# EAGLE design IOIO Pump (EAGLE 6.3)
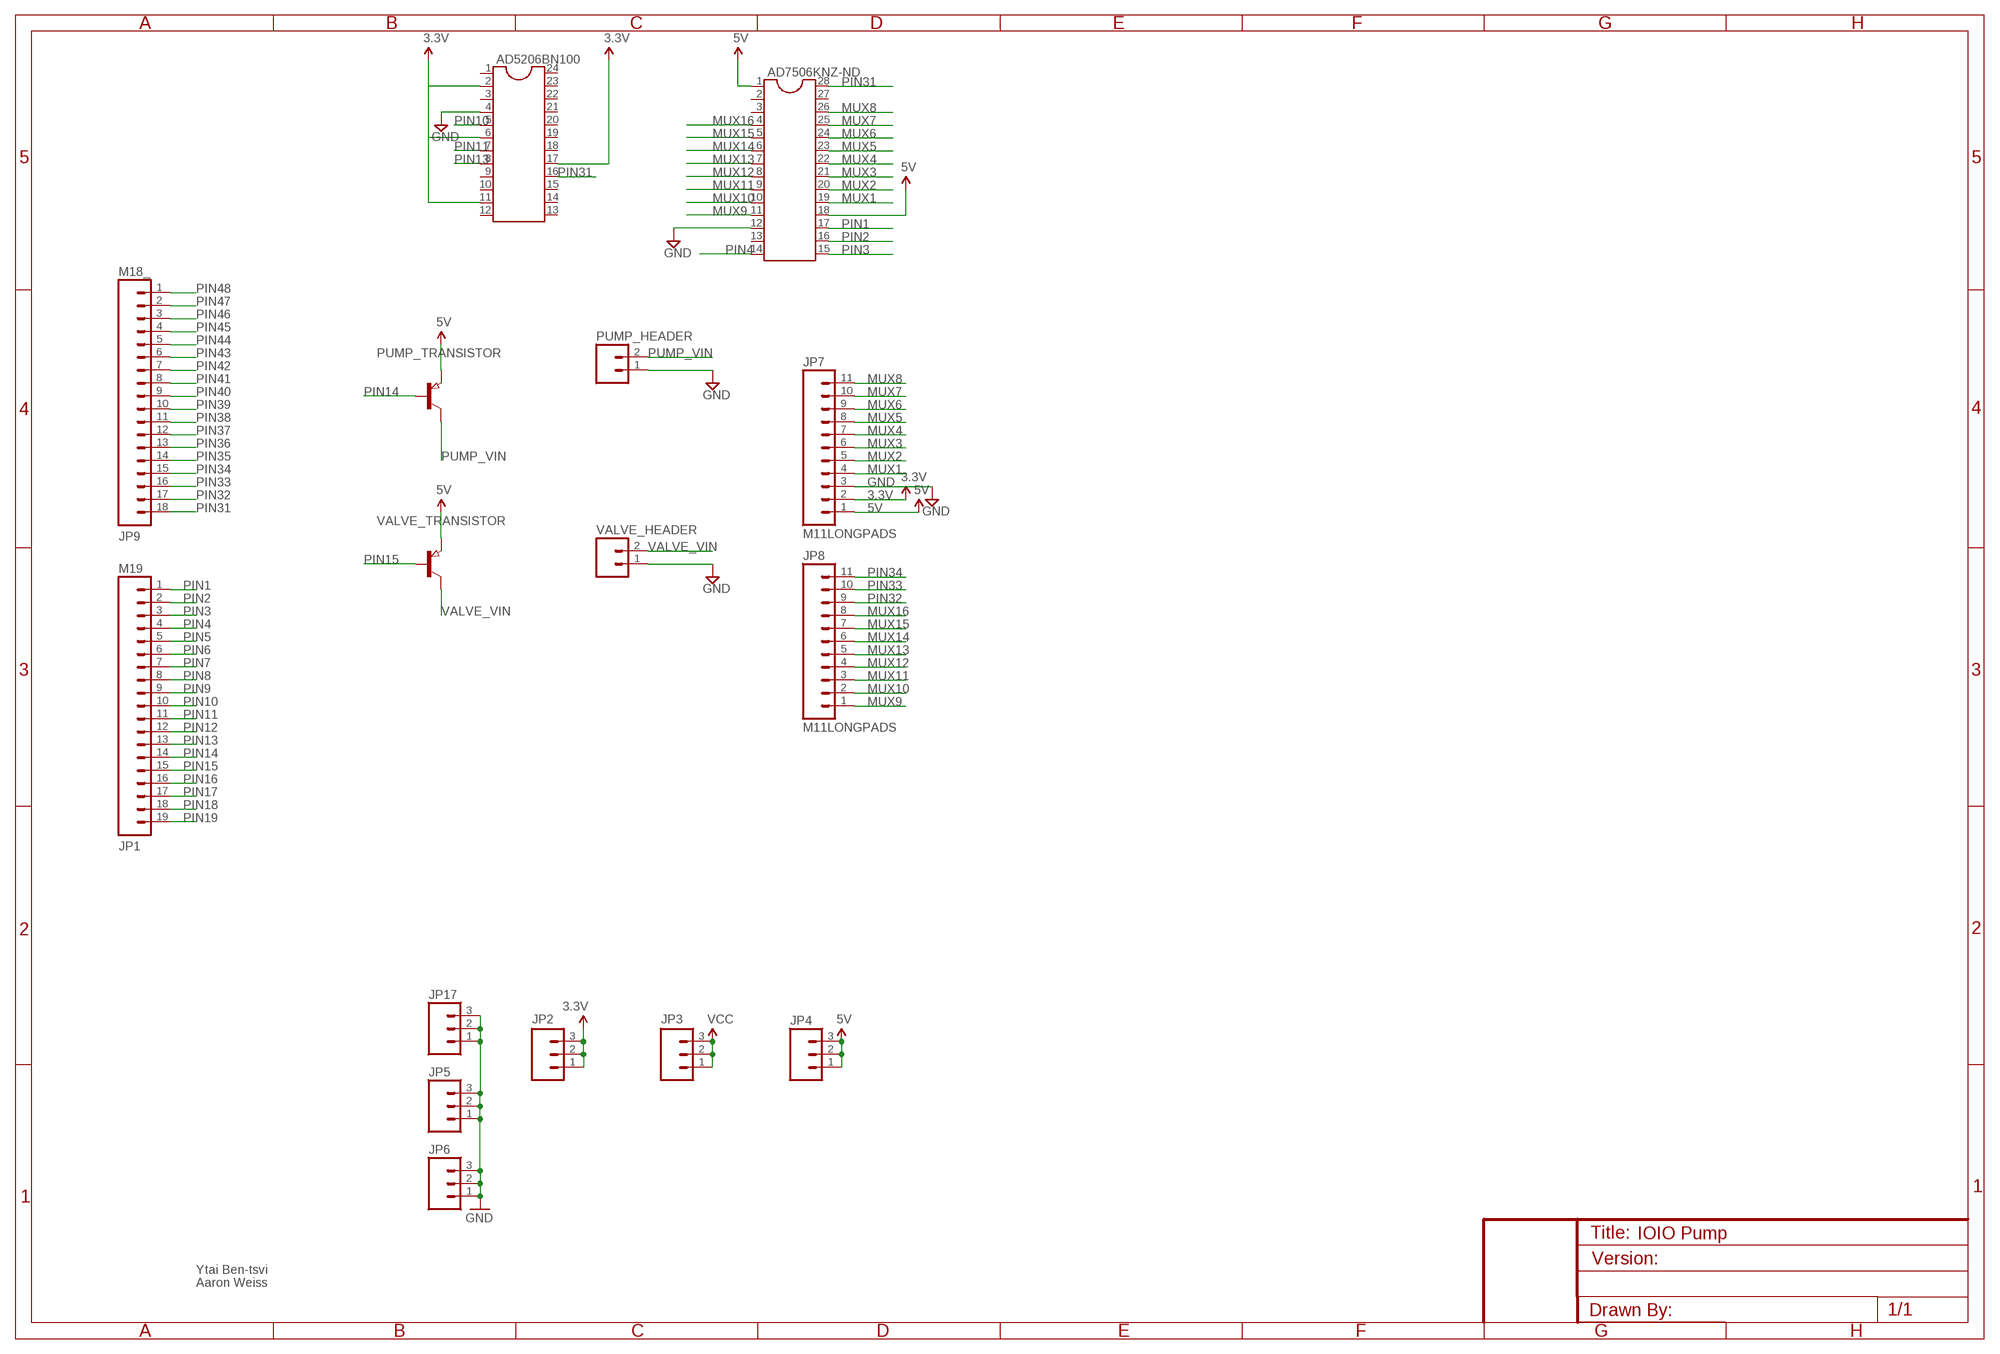
[diagram p0: schematic, sheet 1]

## Parts
AD5206BN100  DIL24-3  [DIL24-3]
AD7506KNZ-ND  DIL28  [DIL28-6]
JP1  M19  [1X19]
JP2  M03PTH  [1X03]
JP3  M03PTH  [1X03]
JP4  M03PTH  [1X03]
JP5  M03PTH  [1X03]
JP6  M03PTH  [1X03]
JP7  M11LONGPADS  [1X11_LONGPADS]
JP8  M11LONGPADS  [1X11_LONGPADS]
JP9  M18_  [1X18]
JP17  M03PTH  [1X03]
PUMP_HEADER  M02PTH  [1X02]
PUMP_TRANSISTOR  PNP-TRANSISTOR_SOT23  [SOT23]
VALVE_HEADER  M02PTH  [1X02]
VALVE_TRANSISTOR  PNP-TRANSISTOR_SOT23  [SOT23]

## Nets
3.3V: AD5206BN100.2 AD5206BN100.6 AD5206BN100.11 AD5206BN100.17 JP2.1 JP2.2 JP2.3 JP7.2
5V: AD7506KNZ-ND.1 AD7506KNZ-ND.18 JP4.1 JP4.2 JP4.3 JP7.1 PUMP_TRANSISTOR.2(E) VALVE_TRANSISTOR.2(E)
GND: AD5206BN100.4 AD7506KNZ-ND.12 JP5.1 JP5.2 JP5.3 JP6.1 JP6.2 JP6.3 JP7.3 JP17.1 JP17.2 JP17.3 PUMP_HEADER.1 VALVE_HEADER.1
MUX1: AD7506KNZ-ND.19 JP7.4
MUX2: AD7506KNZ-ND.20 JP7.5
MUX3: AD7506KNZ-ND.21 JP7.6
MUX4: AD7506KNZ-ND.22 JP7.7
MUX5: AD7506KNZ-ND.23 JP7.8
MUX6: AD7506KNZ-ND.24 JP7.9
MUX7: AD7506KNZ-ND.25 JP7.10
MUX8: AD7506KNZ-ND.26 JP7.11
MUX9: AD7506KNZ-ND.11 JP8.1
MUX10: AD7506KNZ-ND.10 JP8.2
MUX11: AD7506KNZ-ND.9 JP8.3
MUX12: AD7506KNZ-ND.8 JP8.4
MUX13: AD7506KNZ-ND.7 JP8.5
MUX14: AD7506KNZ-ND.6 JP8.6
MUX15: AD7506KNZ-ND.5 JP8.7
MUX16: AD7506KNZ-ND.4 JP8.8
PIN1: AD7506KNZ-ND.17 JP1.1
PIN2: AD7506KNZ-ND.16 JP1.2
PIN3: AD7506KNZ-ND.15 JP1.3
PIN4: AD7506KNZ-ND.14 JP1.4
PIN5: JP1.5
PIN6: JP1.6
PIN7: JP1.7
PIN8: JP1.8
PIN9: JP1.9
PIN10: AD5206BN100.5 JP1.10
PIN11: AD5206BN100.7 JP1.11
PIN12: JP1.12
PIN13: AD5206BN100.8 JP1.13
PIN14: JP1.14 PUMP_TRANSISTOR.1(B)
PIN15: JP1.15 VALVE_TRANSISTOR.1(B)
PIN16: JP1.16
PIN17: JP1.17
PIN18: JP1.18
PIN19: JP1.19
PIN31: AD5206BN100.16 AD7506KNZ-ND.28 JP9.18
PIN32: JP8.9 JP9.17
PIN33: JP8.10 JP9.16
PIN34: JP8.11 JP9.15
PIN35: JP9.14
PIN36: JP9.13
PIN37: JP9.12
PIN38: JP9.11
PIN39: JP9.10
PIN40: JP9.9
PIN41: JP9.8
PIN42: JP9.7
PIN43: JP9.6
PIN44: JP9.5
PIN45: JP9.4
PIN46: JP9.3
PIN47: JP9.2
PIN48: JP9.1
PUMP_VIN: PUMP_HEADER.2 PUMP_TRANSISTOR.3(C)
VALVE_VIN: VALVE_HEADER.2 VALVE_TRANSISTOR.3(C)
VCC: JP3.1 JP3.2 JP3.3
Unconnected: AD5206BN100.1 AD5206BN100.3 AD5206BN100.9 AD5206BN100.10 AD5206BN100.12 AD5206BN100.13 AD5206BN100.14 AD5206BN100.15 AD5206BN100.18 AD5206BN100.19 AD5206BN100.20 AD5206BN100.21 AD5206BN100.22 AD5206BN100.23 AD5206BN100.24 AD7506KNZ-ND.2 AD7506KNZ-ND.3 AD7506KNZ-ND.13 AD7506KNZ-ND.27

## Notes on the sheet
- Ytai Ben-tsvi
- Aaron Weiss

## Library data of the parts
AD5206BN100 = ic-package:DIL24: Dual In Line
AD7506KNZ-ND = ic-package:DIL28: Dual In Line
JP1 = SparkFun:M19
JP2-JP6 JP17 = SparkFun:M03: Header 3 Standard 3-pin 0.1" header. Use with straight break away headers (SKU : PRT-00116), right angle break away headers (PRT-00553), swiss pins (PRT-00743), machine pins (PRT-00117), and female headers (PRT-00115). Molex polarized connector foot print use with SKU : PRT-08232 with associated crimp pins and housings.
JP7 JP8 = SparkFun:M11: Header 11 Standard 11-pin 0.1" header. Use with straight break away headers (SKU : PRT-00116), right angle break away headers (PRT-00553), swiss pins (PRT-00743), machine pins (PRT-00117), and female headers (PRT-00115).
JP9 = SparkFun:M18
PUMP_HEADER VALVE_HEADER = SparkFun:M02: Header 2 Standard 2-pin 0.1" header. Use with straight break away headers (SKU : PRT-00116), right angle break away headers (PRT-00553), swiss pins (PRT-00743), machine pins (PRT-00117), and female headers (PRT-00115). Molex polarized connector foot print use with SKU : PRT-08233 with associated crimp pins and housings.
PUMP_TRANSISTOR VALVE_TRANSISTOR = semicon-smd-ipc:PNP-TRANSISTOR_: PNP TRANSISTOR

## Board
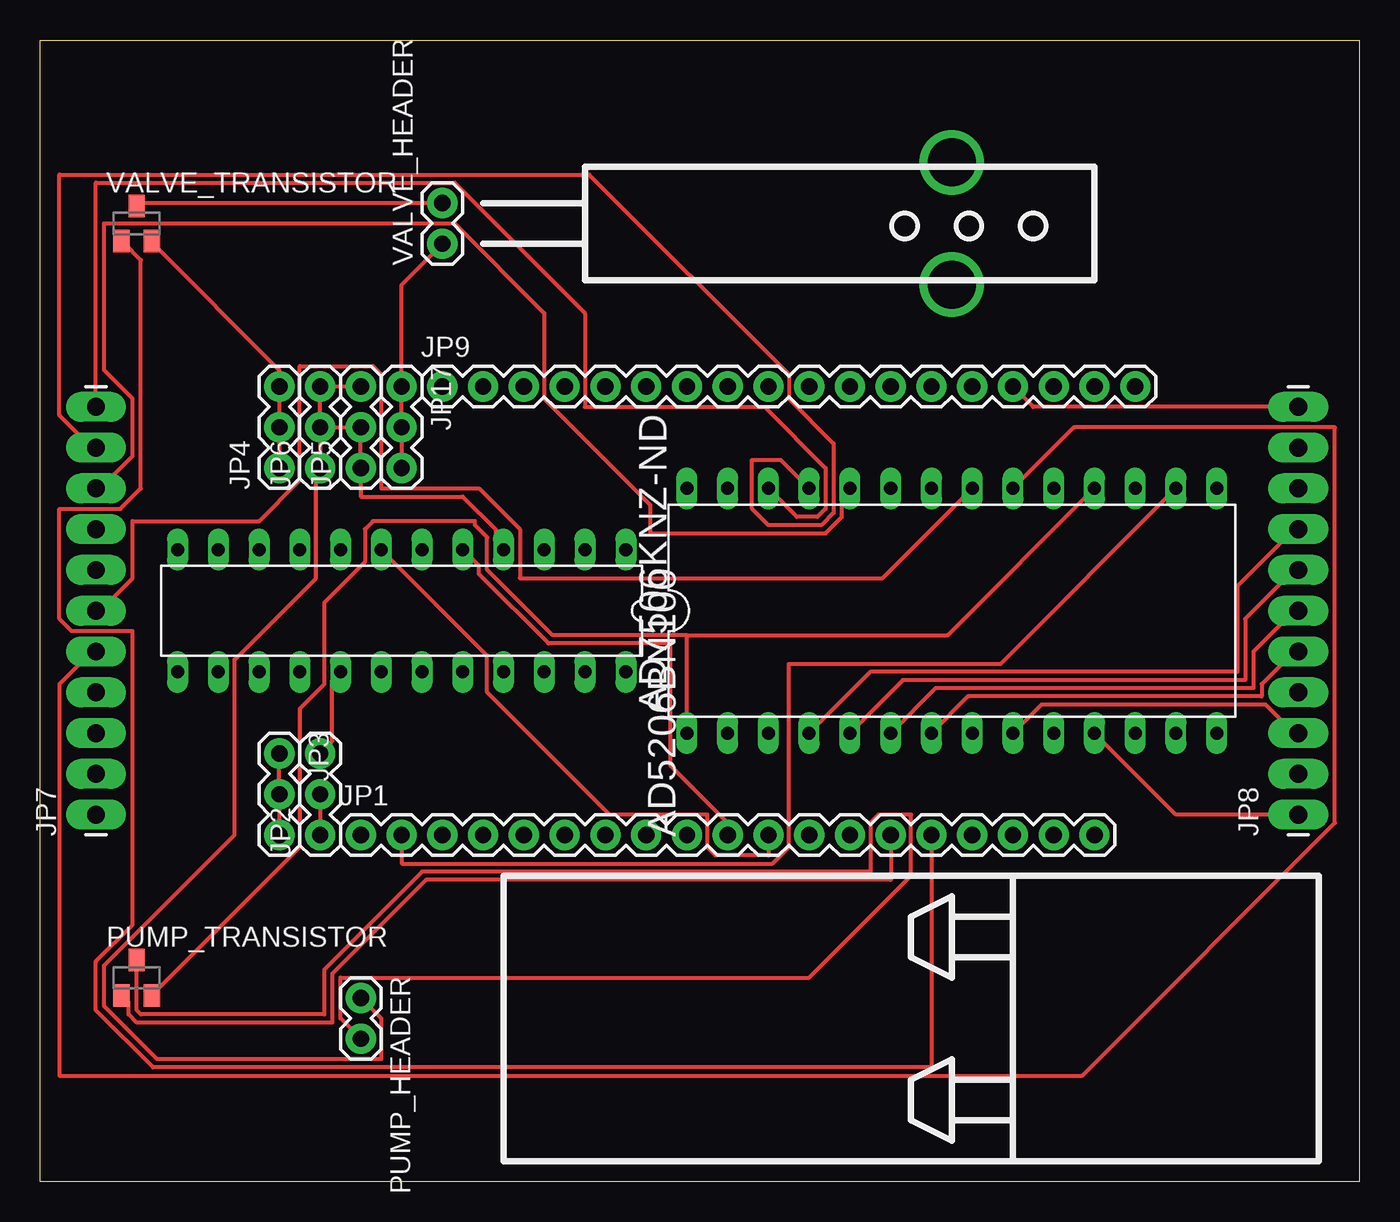
[diagram p1: board, top side]
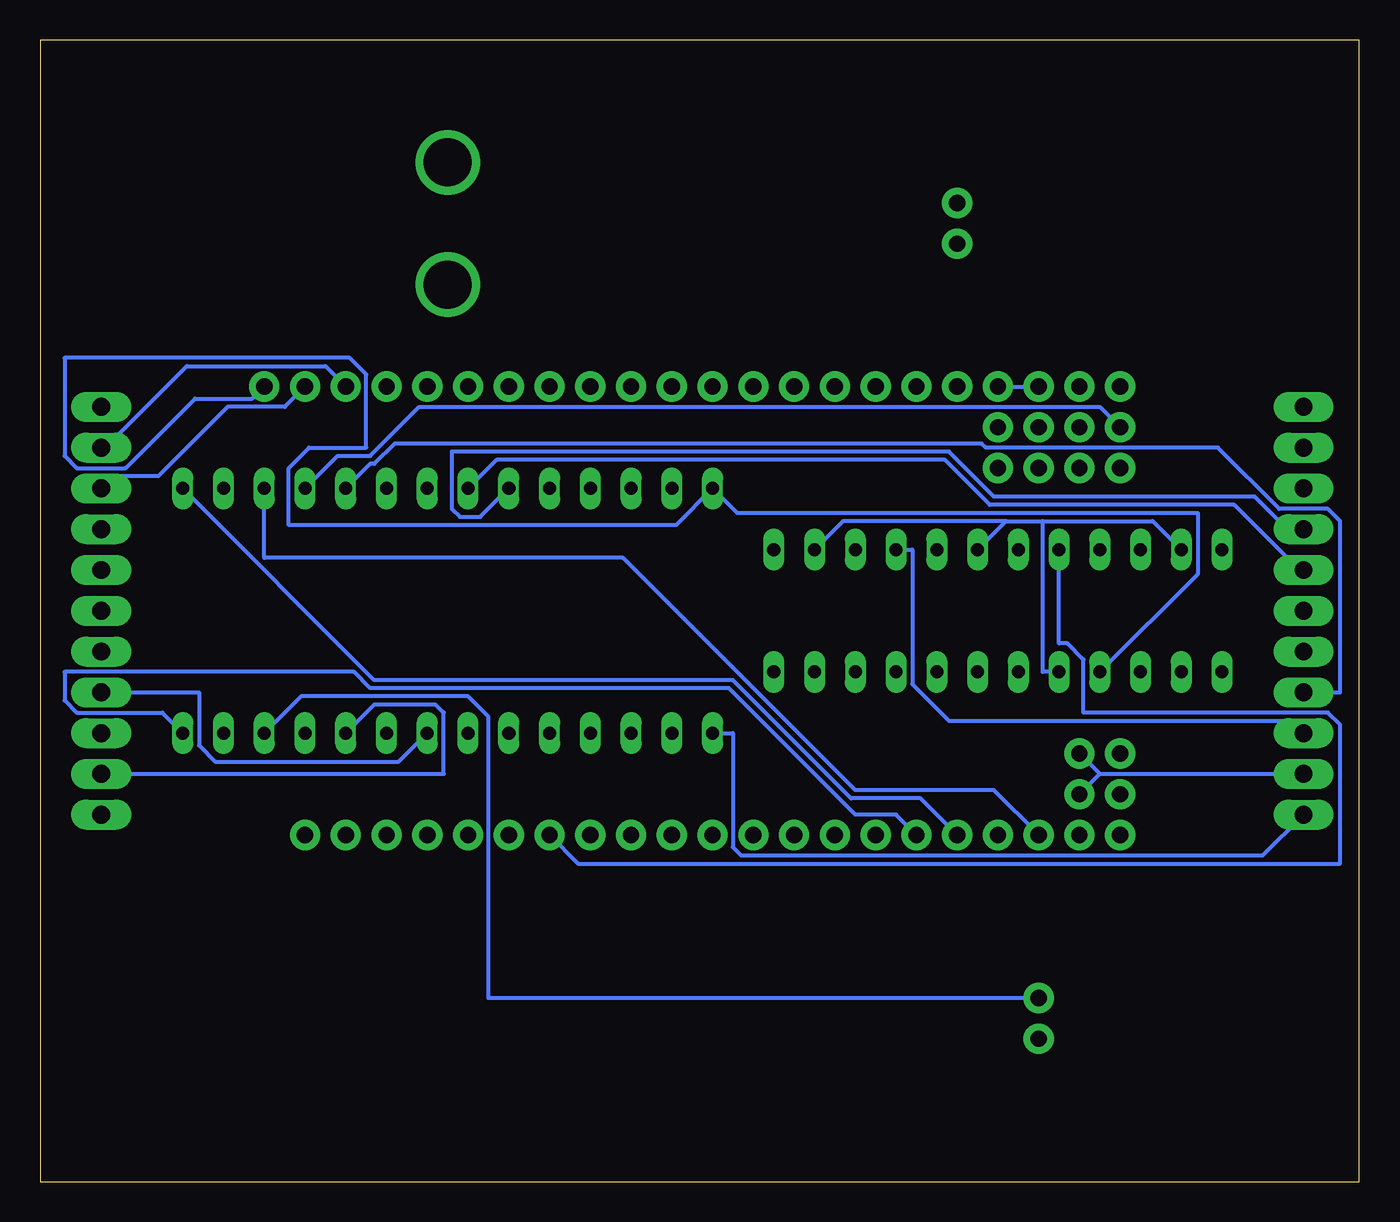
[diagram p2: board, bottom side, seen from below]

Size 82.22 x 71.11 mm. Coordinates in mm from the lower left corner, seen from the top.
Outline: 82.22,0 0,0 0,71.11 82.22,71.11 82.22,0
Copper layers (1*16): Top 0.035mm / dielectric 1.5mm / Bottom 0.035mm
Design rules "default": minimum track width 10mil, minimum drill 24mil, track to track 8mil, track to pad 8mil, pad to pad 8mil, via to via 8mil, smd to smd 8mil, copper to edge 40mil, drill to drill 8mil, minimum pad ring 10mil, minimum via ring 8mil, stop-mask expansion 4mil, vias tented up to drill 0mil, thermal gap 10mil

### Footprints (pad centres in the part's own frame; a part is rotated, then mirrored left to right if it is on the bottom)
DIL24-3 = drill 0.813 long: 1 -13.97,-3.81; 2 -11.43,-3.81; 3 -8.89,-3.81; 4 -6.35,-3.81; 5 -3.81,-3.81; 6 -1.27,-3.81; 7 1.27,-3.81; 8 3.81,-3.81; 9 6.35,-3.81; 10 8.89,-3.81; 11 11.43,-3.81; 12 13.97,-3.81; 13 13.97,3.81; 14 11.43,3.81; 15 8.89,3.81; 16 6.35,3.81; 17 3.81,3.81; 18 1.27,3.81; 19 -1.27,3.81; 20 -3.81,3.81; 21 -6.35,3.81; 22 -8.89,3.81; 23 -11.43,3.81; 24 -13.97,3.81
DIL28-6 = drill 0.813 long: 1 -16.51,-7.62; 2 -13.97,-7.62; 3 -11.43,-7.62; 4 -8.89,-7.62; 5 -6.35,-7.62; 6 -3.81,-7.62; 7 -1.27,-7.62; 8 1.27,-7.62; 9 3.81,-7.62; 10 6.35,-7.62; 11 8.89,-7.62; 12 11.43,-7.62; 13 13.97,-7.62; 14 16.51,-7.62; 15 16.51,7.62; 16 13.97,7.62; 17 11.43,7.62; 18 8.89,7.62; 19 6.35,7.62; 20 3.81,7.62; 21 1.27,7.62; 22 -1.27,7.62; 23 -3.81,7.62; 24 -6.35,7.62; 25 -8.89,7.62; 26 -11.43,7.62; 27 -13.97,7.62; 28 -16.51,7.62
1X19 = drill 1.016 pad 1.88: 1 0,0; 2 2.54,0; 3 5.08,0; 4 7.62,0; 5 10.16,0; 6 12.7,0; 7 15.24,0; 8 17.78,0; 9 20.32,0; 10 22.86,0; 11 25.4,0; 12 27.94,0; 13 30.48,0; 14 33.02,0; 15 35.56,0; 16 38.1,0; 17 40.64,0; 18 43.18,0; 19 45.72,0
1X03 = drill 1.016 pad 1.88: 1 0,0; 2 2.54,0; 3 5.08,0
1X11_LONGPADS = drill 1.118 pad 1.88 long: 1 0,0; 2 2.54,0; 3 5.08,0; 4 7.62,0; 5 10.16,0; 6 12.7,0; 7 15.24,0; 8 17.78,0; 9 20.32,0; 10 22.86,0; 11 25.4,0
1X18 = drill 1.016 pad 1.88: 1 0,0; 2 2.54,0; 3 5.08,0; 4 7.62,0; 5 10.16,0; 6 12.7,0; 7 15.24,0; 8 17.78,0; 9 20.32,0; 10 22.86,0; 11 25.4,0; 12 27.94,0; 13 30.48,0; 14 33.02,0; 15 35.56,0; 16 38.1,0; 17 40.64,0; 18 43.18,0
1X02 = drill 1.016 pad 1.88: 1 0,0; 2 2.54,0
SOT23 = smd 1 x 1.4: 1 -0.95,-1.1; 2 0.95,-1.1; 3 0,1.1

### Placement (x,y rotation side)
AD5206BN100  22.53,35.56 180 top
AD7506KNZ-ND  56.82,35.56 0 top
JP1  19.99,21.59 0 top
JP2  17.45,21.59 90 top
JP3  14.91,26.67 270 top
JP4  14.91,44.45 90 top
JP5  19.99,44.45 90 top
JP6  17.45,44.45 90 top
JP7  3.48,22.86 90 top
JP8  78.41,22.86 90 top
JP9  25.07,49.53 0 top
JP17  22.53,49.53 270 top
PUMP_HEADER  19.99,11.43 270 top
PUMP_TRANSISTOR  6.02,12.7 0 top
VALVE_HEADER  25.07,58.42 90 top
VALVE_TRANSISTOR  6.02,59.69 0 top

### Tracks (layer width: path | path; a pad name or v marks a point on that pad's centre or on a via)
3.3V
  Top 0.254: JP2.2 JP2.1 | AD5206BN100.17 18.21,31.24 18.21,27.43 JP2.3
  Bottom 0.254: AD5206BN100.11 12.88,41.15 19.74,41.15 | 22.02,41.15 19.74,41.15 | AD5206BN100.6 22.02,41.15 | AD5206BN100.2 32.18,41.15 22.02,41.15 | 16.18,25.4 JP7.2 | JP2.3 16.18,25.4 | 16.18,25.4 JP2.2 | 19.74,41.15 19.74,31.75 AD5206BN100.17
5V
  Top 0.254: JP4.1 JP4.2 JP4.3 14.91,50.55 7.04,58.42 VALVE_TRANSISTOR.2 | 40.31,34.04 31.93,34.04 27.86,38.1 27.86,40.13 27.1,40.89 27.1,41.15 20.75,41.15 20.24,40.64 20.24,38.61 17.7,36.07 17.7,30.99 16.18,29.46 16.18,20.83 7.04,11.68 PUMP_TRANSISTOR.2 | AD7506KNZ-ND.1 40.31,34.04 | AD7506KNZ-ND.18 56.57,34.04 40.31,34.04
  Bottom 0.254: JP7.1 6.02,20.32 38.53,20.32 39.04,20.83 39.04,27.94 AD7506KNZ-ND.1 | JP4.2 16.18,48.26 58.6,48.26 61.65,45.21 63.68,45.21 AD7506KNZ-ND.18
GND
  Top 0.254: JP5.3 JP6.3 JP6.2 | JP6.2 JP6.1 17.2,44.2 17.2,37.59 12.12,32.51 12.12,21.59 3.99,13.46 3.99,10.92 7.29,7.62 21.26,7.62 21.26,10.16 PUMP_HEADER.1 | JP6.2 JP5.2 JP5.1 19.99,42.67 26.34,42.67 28.37,40.64 28.37,39.88 AD5206BN100.4 | JP17.3 JP17.2 JP17.1 22.53,55.88 VALVE_HEADER.1
  Bottom 0.254: JP17.1 JP5.3 | JP7.3 4.24,28.7 25.58,28.7 27.86,30.99 27.86,39.37 AD5206BN100.4 | AD7506KNZ-ND.12 65.96,30.23 55.55,30.23 54.28,28.96 54.28,11.43 PUMP_HEADER.1
MUX1
  Bottom 0.254: AD7506KNZ-ND.19 61.65,44.7 61.39,44.7 60.12,45.97 23.55,45.97 23.29,45.72 8.81,45.72 5,41.91 1.96,41.91 1.19,41.15 1.19,30.48 JP7.4
MUX2
  Top 0.254: AD7506KNZ-ND.20 64.44,46.99 80.7,46.99 80.7,22.35 64.95,6.6 1.19,6.6 1.19,30.99 3.23,33.02 JP7.5
MUX3
  Top 0.254: AD7506KNZ-ND.21 52.5,37.59 29.9,37.59 29.9,40.64 27.36,43.18 21.26,43.18 21.26,50.29 20.75,50.8 16.18,50.8 16.18,43.69 13.64,41.15 5.77,41.15 5.77,37.59 3.73,35.56 JP7.6
MUX4
  Bottom 0.254: AD7506KNZ-ND.22 53.77,44.96 25.83,44.96 23.04,42.16 7.8,42.16 3.73,38.1 JP7.7
MUX5
  Bottom 0.254: AD7506KNZ-ND.23 54.79,41.4 56.06,41.4 56.57,41.91 56.57,45.47 25.58,45.47 22.78,42.67 6.53,42.67 4.5,40.64 JP7.8
MUX6
  Top 0.254: AD7506KNZ-ND.24 49.96,42.67 49.96,41.4 48.95,40.39 38.02,40.39 38.02,42.16 31.42,48.77 31.42,54.1 25.83,59.69 3.99,59.69 3.99,50.55 5.77,48.77 5.77,45.21 3.73,43.18 JP7.9
MUX7
  Top 0.254: AD7506KNZ-ND.25 46.15,44.96 44.37,44.96 44.37,41.91 45.39,40.89 48.69,40.89 49.45,41.66 49.45,45.97 46.66,48.77 46.66,50.29 34.21,62.74 1.19,62.74 1.19,47.75 3.23,45.72 JP7.10
MUX8
  Top 0.254: AD7506KNZ-ND.26 47.17,41.4 48.44,41.4 48.95,41.91 48.95,44.45 45.14,48.26 33.96,48.26 33.96,54.1 25.83,62.23 3.48,62.23 JP7.11
MUX9
  Top 0.254: AD7506KNZ-ND.11 70.79,22.86 JP8.1
MUX10
  Bottom 0.254: AD7506KNZ-ND.10 61.39,29.72 57.58,29.72 57.07,29.21 57.07,25.4 JP8.2
MUX11
  Top 0.254: AD7506KNZ-ND.9 62.41,29.72 76.38,29.72 78.16,27.94 JP8.3
MUX12
  Bottom 0.254: AD7506KNZ-ND.8 59.87,26.16 71.3,26.16 72.31,27.18 72.31,30.48 JP8.4
MUX13
  Top 0.254: AD7506KNZ-ND.7 57.84,30.23 76.12,30.23 76.12,30.99 78.16,33.02 JP8.5
MUX14
  Top 0.254: AD7506KNZ-ND.6 55.8,30.73 75.62,30.73 75.62,33.02 78.16,35.56 JP8.6
MUX15
  Top 0.254: AD7506KNZ-ND.5 53.77,31.24 75.11,31.24 75.11,35.05 78.16,38.1 JP8.7
MUX16
  Top 0.254: AD7506KNZ-ND.4 51.74,31.75 74.6,31.75 74.6,37.08 78.16,40.64 JP8.8
N$1  (via drill 3)
  other vias: 56.82,55.88
N$2  (via drill 3)
  other vias: 56.82,63.5
PIN1
  Bottom 0.254: AD7506KNZ-ND.17 68.25,38.86 45.9,38.86 31.42,24.38 22.78,24.38 JP1.1
PIN2
  Top 0.254: AD7506KNZ-ND.16 59.87,32.26 46.66,32.26 46.66,20.83 45.64,19.81 22.53,19.81 JP1.2
PIN3
  Bottom 0.254: AD7506KNZ-ND.15 61.39,31.24 39.04,31.24 31.67,23.88 27.36,23.88 JP1.3
PIN4
  Bottom 0.254: AD7506KNZ-ND.14 74.6,29.21 79.93,29.21 80.7,29.97 80.7,31.75 62.66,31.75 61.65,30.73 39.29,30.73 31.42,22.86 28.88,22.86 JP1.4
PIN10
  Top 0.254: AD5206BN100.5 27.36,38.35 27.36,37.85 31.67,33.53 39.29,33.53 39.29,25.91 42.85,22.35 JP1.10
PIN11
  Top 0.254: AD5206BN100.7 27.86,32.77 27.86,30.48 35.48,22.86 41.58,22.86 41.58,20.83 42.09,20.32 45.39,20.32 JP1.11
PIN13
  Bottom 0.254: AD5206BN100.8 18.72,33.53 18.21,33.53 17.2,32.51 17.2,29.21 1.96,29.21 1.19,28.45 1.19,19.81 48.69,19.81 JP1.13
PIN14
  Top 0.254: JP1.14 53.01,18.8 24.05,18.8 18.21,12.95 18.21,9.91 6.02,9.91 5.51,10.41 5.51,11.18 5.26,11.43 PUMP_TRANSISTOR.1
PIN15
  Top 0.254: JP1.15 55.55,7.11 7.04,7.11 3.48,10.67 3.48,13.72 5.77,16 5.77,34.29 1.96,34.29 1.19,35.05 1.19,41.91 5,41.91 6.27,43.18 6.27,57.4 5.26,58.42 VALVE_TRANSISTOR.1
PIN31
  Bottom 0.254: AD5206BN100.16 10.08,37.85 10.08,41.66 38.79,41.66 AD7506KNZ-ND.28 42.6,40.89 66.73,40.89 66.73,44.45 65.46,45.72 61.9,45.72 61.9,50.29 62.92,51.31 80.7,51.31 80.7,45.21 79.93,44.45 76.89,44.45 72.57,48.77 69.01,48.77 JP9.18
PIN32
  Bottom 0.254: JP8.9 77.65,43.94 74.85,43.94 70.54,48.26 66.98,48.26 JP9.17
PIN33
  Bottom 0.254: JP9.16 64.44,50.8 73.08,50.8 78.16,45.72 JP8.10
PIN34
  Top 0.254: JP9.15 61.9,48.26 JP8.11
PUMP_VIN
  Top 0.254: PUMP_TRANSISTOR.3 6.02,10.67 6.27,10.41 17.7,10.41 17.7,13.21 23.8,19.3 51.74,19.3 51.74,22.35 52.25,22.86 54.28,22.86 54.28,19.05 47.93,12.7 18.72,12.7 18.72,10.16 PUMP_HEADER.2
VALVE_VIN
  Top 0.254: VALVE_HEADER.2 6.02,60.96 VALVE_TRANSISTOR.3
VCC
  Top 0.254: JP3.3 JP3.2 JP3.1